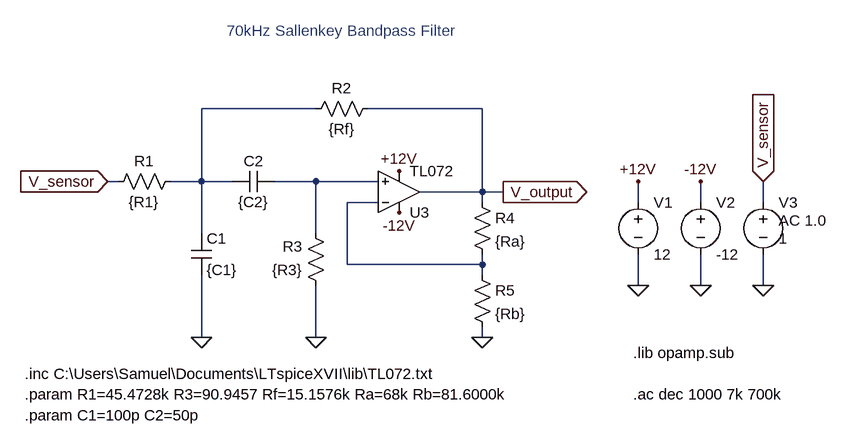
[diagram p0: schematic SallenKeyBandPassFIlter.asc]
SallenKeyBandPassFIlter.asc, the LTspice schematic file:
Version 4
SHEET 1 2508 680
WIRE -624 -496 -800 -496
WIRE -368 -496 -544 -496
WIRE -928 -384 -944 -384
WIRE -800 -384 -800 -496
WIRE -800 -384 -848 -384
WIRE -752 -384 -800 -384
WIRE -624 -384 -688 -384
WIRE -528 -384 -624 -384
WIRE -368 -368 -368 -496
WIRE -368 -368 -464 -368
WIRE -336 -368 -368 -368
WIRE -528 -352 -576 -352
WIRE -368 -352 -368 -368
WIRE -128 -352 -128 -384
WIRE -32 -352 -32 -384
WIRE 64 -352 64 -384
WIRE -800 -304 -800 -384
WIRE -624 -304 -624 -384
WIRE -576 -256 -576 -352
WIRE -368 -256 -368 -272
WIRE -368 -256 -576 -256
WIRE -368 -240 -368 -256
WIRE -128 -224 -128 -272
WIRE -32 -224 -32 -272
WIRE 64 -224 64 -272
WIRE -800 -144 -800 -240
WIRE -624 -144 -624 -224
WIRE -368 -144 -368 -160
FLAG -32 -224 0
FLAG -128 -224 0
FLAG -128 -384 +12V
FLAG -32 -384 -12V
FLAG -336 -368 V_output
IOPIN -336 -368 Out
FLAG -496 -400 +12V
FLAG -496 -336 -12V
FLAG -944 -384 V_sensor
IOPIN -944 -384 In
FLAG 64 -224 0
FLAG 64 -384 V_sensor
IOPIN 64 -384 In
FLAG -800 -144 0
FLAG -624 -144 0
FLAG -368 -144 0
SYMBOL voltage -128 -368 R0
WINDOW 123 0 0 Left 2
WINDOW 39 0 0 Left 2
SYMATTR InstName V1
SYMATTR Value 12
SYMBOL voltage -32 -368 R0
WINDOW 123 0 0 Left 2
WINDOW 39 0 0 Left 2
SYMATTR InstName V2
SYMATTR Value -12
SYMBOL Opamps\\opamp2 -496 -304 M180
SYMATTR InstName U3
SYMATTR Value TL072
SYMBOL cap -816 -304 R0
SYMATTR InstName C1
SYMATTR Value {C1}
SYMBOL cap -688 -400 R90
WINDOW 0 0 32 VBottom 2
WINDOW 3 32 32 VTop 2
SYMATTR InstName C2
SYMATTR Value {C2}
SYMBOL voltage 64 -368 R0
WINDOW 123 24 44 Left 2
WINDOW 39 0 0 Left 2
WINDOW 3 24 72 Left 2
SYMATTR Value2 AC 1.0
SYMATTR Value 1
SYMATTR InstName V3
SYMBOL res -832 -400 R90
WINDOW 0 0 56 VBottom 2
WINDOW 3 32 56 VTop 2
SYMATTR InstName R1
SYMATTR Value {R1}
SYMBOL res -640 -480 R270
WINDOW 0 32 56 VTop 2
WINDOW 3 0 56 VBottom 2
SYMATTR InstName R2
SYMATTR Value {Rf}
SYMBOL res -608 -208 R180
WINDOW 0 36 76 Left 2
WINDOW 3 36 40 Left 2
SYMATTR InstName R3
SYMATTR Value {R3}
SYMBOL res -384 -368 R0
SYMATTR InstName R4
SYMATTR Value {Ra}
SYMBOL res -384 -256 R0
SYMATTR InstName R5
SYMATTR Value {Rb}
TEXT -136 -120 Left 2 !.lib opamp.sub
TEXT -584 -616 Center 2 ;70kHz Sallenkey Bandpass Filter
TEXT -136 -56 Left 2 !.ac dec 1000 7k 700k
TEXT -1072 -88 Left 2 !.inc C:\\Users\\Samuel\\Documents\\LTspiceXVII\\lib\\TL072.txt
TEXT -1072 -56 Left 2 !.param R1=45.4728k R3=90.9457 Rf=15.1576k Ra=68k Rb=81.6000k
TEXT -1072 -24 Left 2 !.param C1=100p C2=50p

The netlist it stands for:
* SallenKeyBandPassFIlter.asc
V1 +12V 0 12
V2 -12V 0 -12
XU3 N002 N003 -12V +12V V_output TL072  ; pins In+ In- V+ V- OUT
C1 N001 0 {C1}
C2 N002 N001 {C2}
V3 V_sensor 0 1 AC 1.0
R1 N001 V_sensor {R1}
R2 N001 V_output {Rf}
R3 0 N002 {R3}
R4 V_output N003 {Ra}
R5 N003 0 {Rb}
.lib opamp.sub
* 70kHz Sallenkey Bandpass Filter
.ac dec 1000 7k 700k
.inc C:\Users\Samuel\Documents\LTspiceXVII\lib\TL072.txt
.param R1=45.4728k R3=90.9457 Rf=15.1576k Ra=68k Rb=81.6000k
.param C1=100p C2=50p
.backanno
.end